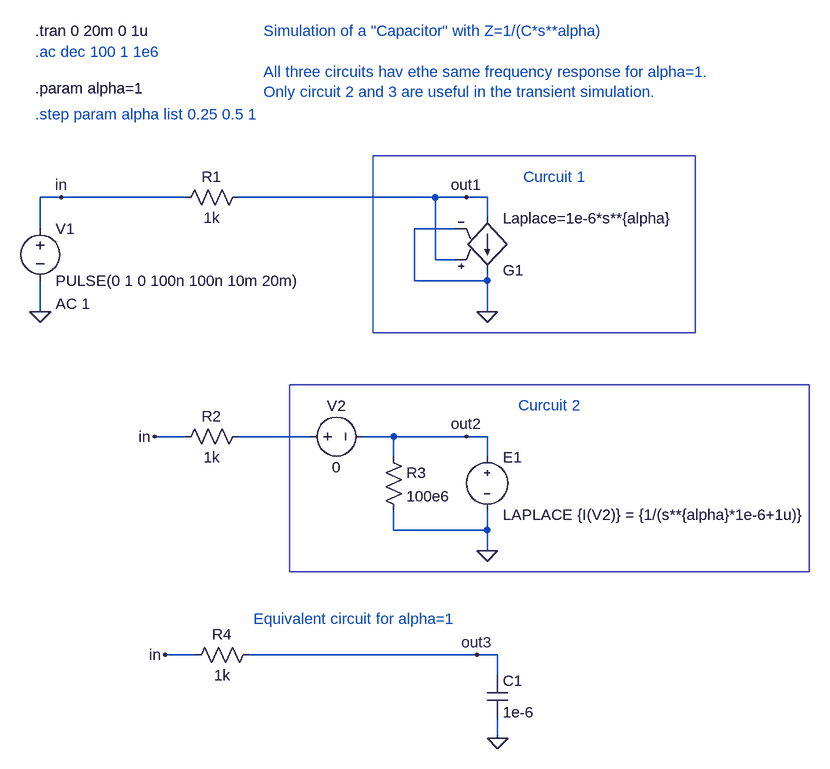
[diagram p0: schematic Constant_phase_element1.asc]
Constant_phase_element1.asc, the LTspice schematic file:
Version 4
SHEET 1 1156 996
WIRE -192 144 -224 144
WIRE 0 144 -192 144
WIRE 384 144 80 144
WIRE 432 144 384 144
WIRE 464 144 432 144
WIRE 464 176 464 144
WIRE -224 192 -224 144
WIRE 416 192 352 192
WIRE 384 240 384 144
WIRE 416 240 384 240
WIRE 352 272 352 192
WIRE 464 272 464 256
WIRE 464 272 352 272
WIRE -224 320 -224 272
WIRE 464 320 464 272
WIRE 0 512 -48 512
WIRE 192 512 80 512
WIRE 320 512 272 512
WIRE 432 512 320 512
WIRE 464 512 432 512
WIRE 320 544 320 512
WIRE 464 544 464 512
WIRE 320 656 320 624
WIRE 464 656 464 624
WIRE 464 656 320 656
WIRE 464 688 464 656
WIRE 16 848 -32 848
WIRE 448 848 96 848
WIRE 480 848 448 848
WIRE 480 880 480 848
WIRE 480 976 480 944
FLAG 464 320 0
FLAG -224 320 0
FLAG 432 144 out1
FLAG 464 688 0
FLAG 432 512 out2
FLAG -192 144 in
FLAG -48 512 in
FLAG 480 976 0
FLAG 448 848 out3
FLAG -32 848 in
SYMBOL res -16 160 R270
WINDOW 0 32 56 VTop 0
WINDOW 3 0 56 VBottom 0
SYMATTR InstName R1
SYMATTR Value 1k
SYMBOL g 464 272 M180
SYMATTR InstName G1
SYMATTR Value Laplace=1e-6*s**{alpha}
SYMBOL voltage -224 176 R0
WINDOW 123 24 132 Left 0
WINDOW 39 0 0 Left 0
SYMATTR Value2 AC 1
SYMATTR InstName V1
SYMATTR Value PULSE(0 1 0 100n 100n 10m 20m)
SYMBOL res -16 528 R270
WINDOW 0 32 56 VTop 0
WINDOW 3 0 56 VBottom 0
SYMATTR InstName R2
SYMATTR Value 1k
SYMBOL voltage 176 512 R270
WINDOW 0 32 56 VTop 0
WINDOW 3 -32 56 VBottom 0
SYMATTR InstName V2
SYMATTR Value 0
SYMBOL Misc\\Epoly 464 528 R0
SYMATTR InstName E1
SYMATTR Value LAPLACE {I(V2)} = {1/(s**{alpha}*1e-6+1u)}
SYMBOL res 304 528 R0
SYMATTR InstName R3
SYMATTR Value 100e6
SYMBOL res 0 864 R270
WINDOW 0 32 56 VTop 0
WINDOW 3 0 56 VBottom 0
SYMATTR InstName R4
SYMATTR Value 1k
SYMBOL cap 464 880 R0
SYMATTR InstName C1
SYMATTR Value 1e-6
TEXT -232 -80 Left 0 ;.ac dec 100 1 1e6
TEXT -232 -24 Left 0 !.param alpha=1
TEXT -232 16 Left 0 ;.step param alpha list 0.25 0.5 1
TEXT -232 -112 Left 0 !.tran 0 20m 0 1u
TEXT 120 -112 Left 0 ;Simulation of a "Capacitor" with Z=1/(C*s**alpha)\n \nAll three circuits hav ethe same frequency response for alpha=1.\nOnly circuit 2 and 3 are useful in the transient simulation.
TEXT 520 112 Left 0 ;Curcuit 1
TEXT 512 464 Left 0 ;Curcuit 2
TEXT 104 792 Left 0 ;Equivalent circuit for alpha=1
RECTANGLE Normal 784 352 288 80
RECTANGLE Normal 960 720 160 432

The netlist it stands for:
* Constant_phase_element1.asc
R1 in out1 1k
G1 out1 0 out1 0 Laplace=1e-6*s**{alpha}
V1 in 0 PULSE(0 1 0 100n 100n 10m 20m) AC 1
R2 in N001 1k
V2 N001 out2 0
E1 out2 0 LAPLACE {I(V2)} = {1/(s**{alpha}*1e-6+1u)}
R3 out2 0 100e6
R4 in out3 1k
C1 out3 0 1e-6
* .ac dec 100 1 1e6
.param alpha=1
* .step param alpha list 0.25 0.5 1
.tran 0 20m 0 1u
* Simulation of a "Capacitor" with Z=1/(C*s**alpha)
* All three circuits hav ethe same frequency response for alpha=1.
* Only circuit 2 and 3 are useful in the transient simulation.
* Curcuit 1
* Curcuit 2
* Equivalent circuit for alpha=1
.backanno
.end